# EAGLE design Decoder Accessori v2 (EAGLE 9.6.2)
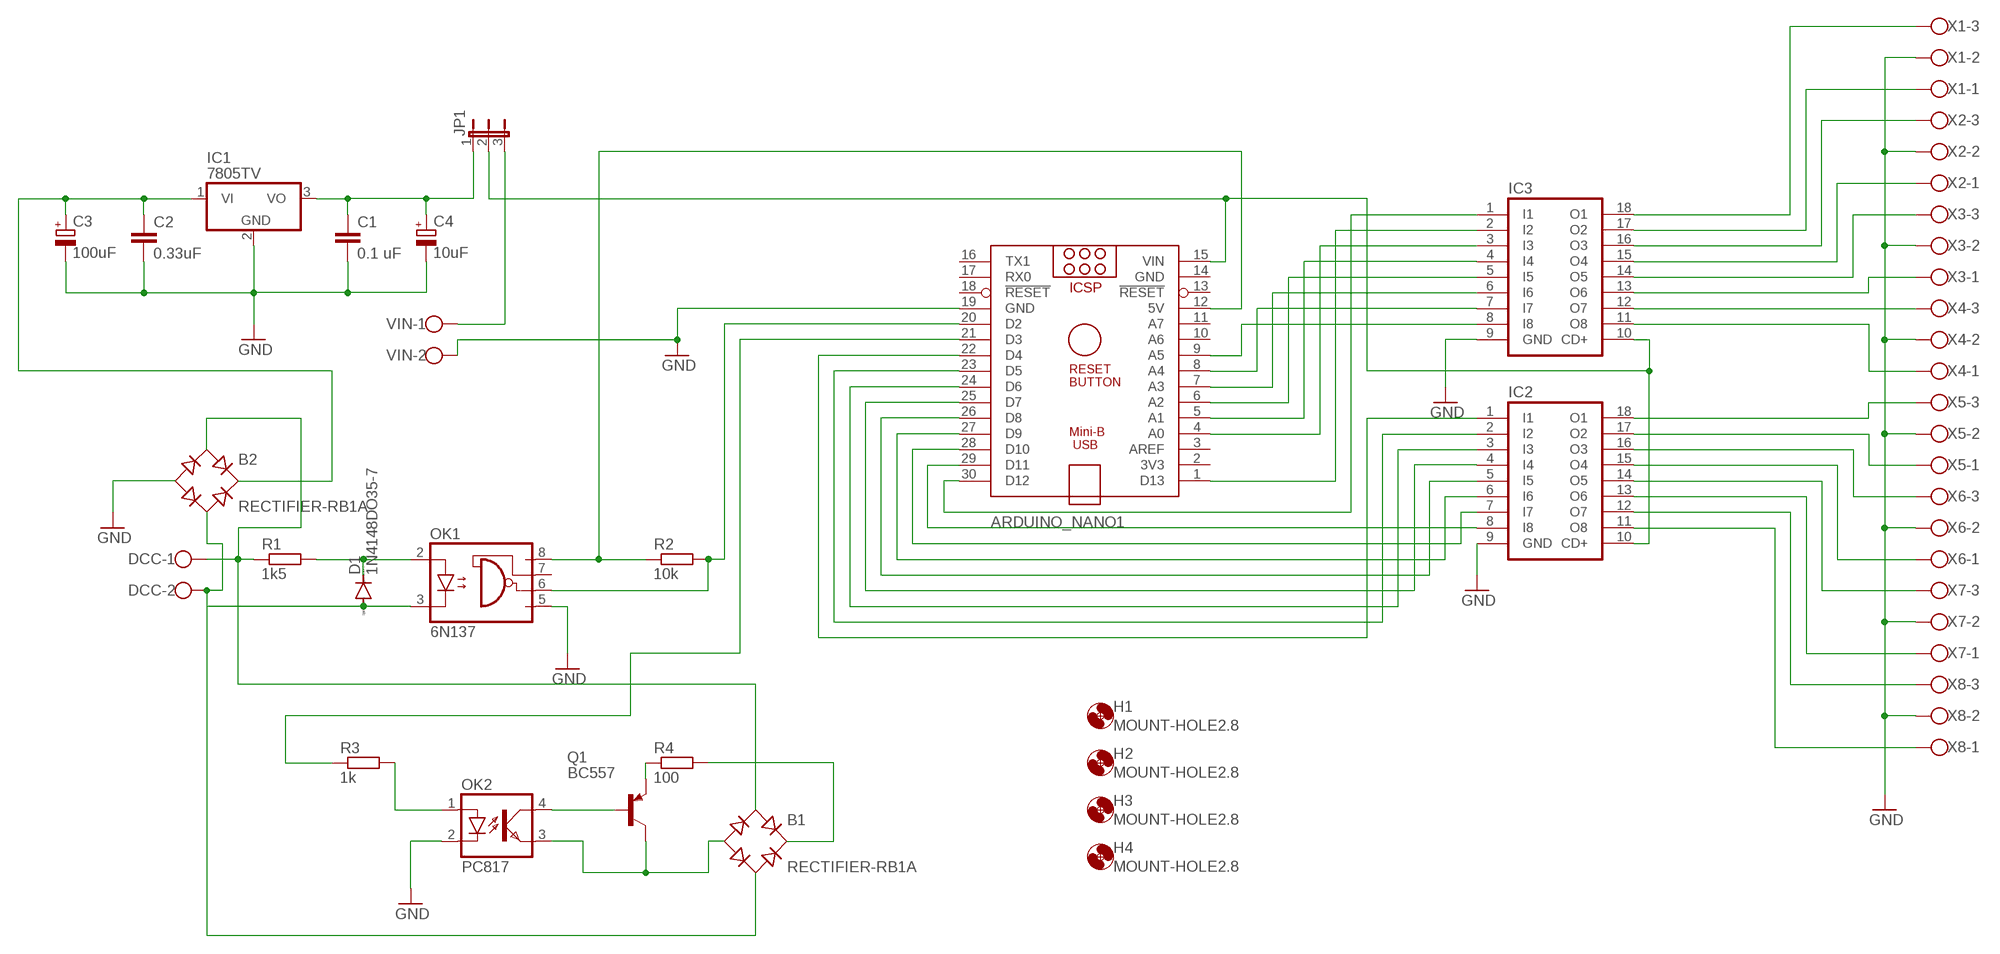
[diagram p0: schematic, sheet 1]

## Parts
ARDUINO_NANO1  ARDUINO_NANO  [ARDUINO_NANO]
B1  RECTIFIER-RB1A  [RB1A]
B2  RECTIFIER-RB1A  [RB1A]
C1  0.1 uF  C-EU025-024X044  [C025-024X044]
C2  0.33uF  C-EU025-024X044  [C025-024X044]
C3  100uF  CPOL-EUTAP5-50  [TAP5-50]
C4  10uF  CPOL-EUTAP5-50  [TAP5-50]
D1  1N4148DO35-7  [DO35-7]
DCC  W237-102  [W237-102]
H1  MOUNT-HOLE2.8  [2,8]
H2  MOUNT-HOLE2.8  [2,8]
H3  MOUNT-HOLE2.8  [2,8]
H4  MOUNT-HOLE2.8  [2,8]
IC1  7805TV  [TO220V]
IC2  ULN2803A  [DIL18]
IC3  ULN2803A  [DIL18]
JP1  JP2E  [JP2]
OK1  6N137  [DIL08]
OK2  PC817  [DIL04]
Q1  BC557  [TO92]
R1  1k5  R-EU_0207/10  [0207/10]
R2  10k  R-EU_0207/10  [0207/10]
R3  1k  R-EU_0207/10  [0207/10]
R4  100  R-EU_0207/10  [0207/10]
VIN  W237-102  [W237-102]
X1  W237-103  [W237-103]
X2  W237-103  [W237-103]
X3  W237-103  [W237-103]
X4  W237-103  [W237-103]
X5  W237-103  [W237-103]
X6  W237-103  [W237-103]
X7  W237-103  [W237-103]
X8  W237-103  [W237-103]

## Nets
GND [GND]: ARDUINO_NANO1.19(GND) B2.- C1.2 C2.2 C3.- C4.- IC1.2(GND) IC2.9(GND) IC3.9(GND) OK1.5(GND) OK2.2(C) VIN.2 X1.2 X2.2 X3.2 X4.2 X5.2 X6.2 X7.2 X8.2
N$1: D1.C OK1.2(A) R1.2
N$2 [DCC]: B1.AC2 B2.AC2 D1.A DCC.2 OK1.3(C)
N$3: ARDUINO_NANO1.12(5V) OK1.8(VCC) R2.1
N$4: ARDUINO_NANO1.20(D2) OK1.6(VO) R2.2
N$5 [DCC]: B1.AC1 B2.AC1 DCC.1 R1.1
N$6: OK2.4(COL) Q1.2(B)
N$7: ARDUINO_NANO1.21(D3) R3.1
N$8: OK2.1(A) R3.2
N$9: B1.- OK2.3(EMIT) Q1.3(C)
N$10: Q1.1(E) R4.1
N$11: B1.+ R4.2
N$12: ARDUINO_NANO1.29(D11) IC2.8(I8)
N$13: ARDUINO_NANO1.28(D10) IC2.7(I7)
N$14 [Vin]: B2.+ C2.1 C3.+ IC1.1(VI)
N$15 [Vin]: ARDUINO_NANO1.15(VIN) IC2.10(CD+) IC3.10(CD+) JP1.2
N$16: ARDUINO_NANO1.27(D9) IC2.6(I6)
N$17: ARDUINO_NANO1.26(D8) IC2.5(I5)
N$18: ARDUINO_NANO1.30(D12) IC3.1(I1)
N$19: ARDUINO_NANO1.25(D7) IC2.4(I4)
N$20: ARDUINO_NANO1.24(D6) IC2.3(I3)
N$21: ARDUINO_NANO1.23(D5) IC2.2(I2)
N$22: ARDUINO_NANO1.22(D4) IC2.1(I1)
N$23: ARDUINO_NANO1.1(D13) IC3.2(I2)
N$24: ARDUINO_NANO1.4(A0) IC3.3(I3)
N$25: ARDUINO_NANO1.6(A2) IC3.5(I5)
N$26: ARDUINO_NANO1.5(A1) IC3.4(I4)
N$27: ARDUINO_NANO1.7(A3) IC3.6(I6)
N$28: ARDUINO_NANO1.8(A4) IC3.7(I7)
N$29 [POWER]: IC3.11(O8) X4.1
N$30: ARDUINO_NANO1.9(A5) IC3.8(I8)
N$31 [POWER]: IC3.12(O7) X4.3
N$32 [POWER]: IC3.13(O6) X3.1
N$33 [POWER]: IC3.14(O5) X3.3
N$34 [POWER]: IC3.15(O4) X2.1
N$35 [POWER]: IC3.16(O3) X2.3
N$36 [POWER]: IC3.17(O2) X1.1
N$37 [POWER]: IC3.18(O1) X1.3
N$38 [POWER]: IC2.18(O1) X5.3
N$39 [POWER]: IC2.17(O2) X5.1
N$40 [POWER]: IC2.16(O3) X6.3
N$41 [POWER]: IC2.15(O4) X6.1
N$42 [POWER]: IC2.14(O5) X7.3
N$43 [POWER]: IC2.13(O6) X7.1
N$44 [POWER]: IC2.12(O7) X8.3
N$45 [POWER]: IC2.11(O8) X8.1
N$46 [Vin]: C1.1 C4.+ IC1.3(VO) JP1.1
N$47 [Vin]: JP1.3 VIN.1
Unconnected: ARDUINO_NANO1.2(3V3) ARDUINO_NANO1.3(AREF) ARDUINO_NANO1.10(A6) ARDUINO_NANO1.11(A7) ARDUINO_NANO1.13(!RESET) ARDUINO_NANO1.16(TX1) ARDUINO_NANO1.17(RX0) ARDUINO_NANO1.18(!RESET) OK1.7(VE)

## Power pins joined to a net without a drawn wire
GND: ARDUINO_NANO1.14(GND)

## Library data of the parts
ARDUINO_NANO1 = ArduinoNanoV30:ARDUINO_NANO: Arduino Nano V3.0 Overview: The Arduino Nano is a small, complete, and breadboard-friendly board based on the ATmega328 (Arduino Nano 3.x) or ATmega168 (Arduino Nano 2.x). It has more or less the same functionality of the Arduino Duemilanove, but in a different package. It lacks only a DC power jack, and works with a Mini-B USB cable instead of a standard one. The Nano was designed and is being produced by Gravitech. Specifications: Microcontroller Atmel ATmega168 or ATmega328 Operating Voltage (logic level) 5 V Input Voltage (recommended) 7-12 V Input Voltage (limits) 6-20 V Digital I/O Pins 14 (of which 6 provide PWM output) Analog Input Pins 8 DC Current per I/O Pin 40 mA Flash Memory 16 KB (ATmega168) or 32 KB (ATmega328) of which 2 KB used by bootloader SRAM 1 KB (ATmega168) or 2 KB (ATmega328) EEPROM 512 bytes (ATmega168) or 1 KB (ATmega328) Clock Speed 16 MHz Dimensions 0.73" x 1.70" Length 45 mm Width 18 mm Weigth 5 g Power: The Arduino Nano can be powered via the Mini-B USB connection, 6-20V unregulated external power supply (pin 30), or 5V regulated external power supply (pin 27). The power source is automatically selected to the highest voltage source. Memory: The ATmega168 has 16 KB of flash memory for storing code (of which 2 KB is used for the bootloader); the ATmega328 has 32 KB, (also with 2 KB used for the bootloader). The ATmega168 has 1 KB of SRAM and 512 bytes of EEPROM (which can be read and written with the EEPROM library); the ATmega328 has 2 KB of SRAM and 1 KB of EEPROM. Input and Output: Each of the 14 digital pins on the Nano can be used as an input or output, using pinMode(), digitalWrite(), and digitalRead() functions. They operate at 5 volts. Each pin can provide or receive a maximum of 40 mA and has an internal pull-up resistor (disconnected by default) of 20-50 kOhms. In addition, some pins have specialized functions. Visit Arduino - ArduinoBoardNano <https://www.arduino.cc/en/Main/ArduinoBoardNano>
B1 B2 = rectifier:RECTIFIER-: Rectifier
C1 C2 = rcl:C-EU: CAPACITOR, European symbol; SPICEPREFIX: C
C3 C4 = rcl:CPOL-EU: POLARIZED CAPACITOR, European symbol; SPICEPREFIX: C
D1 = diode:1N4148: DIODE high speed (Philips)
DCC VIN = con-wago-500:W237-102: WAGO SCREW CLAMP; MPN: 237-102; OC_FARNELL: unknown; OC_NEWARK: 70K9898
H1-H4 = holes:MOUNT-HOLE: MOUNTING HOLE with drill center marker
IC1 = linear:78*: Positive VOLTAGE REGULATOR Source: http://cache.national.com/ds/LM/LM78L05.pdf http://www.fairchildsemi.com/ds/LM/LM7805.pdf
IC2 IC3 = uln-udn:ULN2803A: DRIVER ARRAY
JP1 = jumper:JP2E: JUMPER
OK1 = optocoupler:6N137: MOTOROLA OPTO COUPLER; MPN: 6N137; OC_FARNELL: 1328376; OC_NEWARK: 52M1895
OK2 = optocoupler:PC817: SHARP OPTO COUPLER; MPN: PC817X4J000F; OC_FARNELL: 9707727; OC_NEWARK: 97K7059
Q1 = transistor-pnp:BC557: PNP Transistor
R1-R4 = rcl:R-EU_: RESISTOR, European symbol; SPICEPREFIX: R
X1-X8 = con-wago-500:W237-103: WAGO SCREW CLAMP; MPN: 237-103; OC_FARNELL: unknown; OC_NEWARK: 18M7116

## Net classes
0 default: width 0.254 mm, clearance 0.254 mm
1 POWER: width 0.635 mm, clearance 0.254 mm
2 DCC: width 0.508 mm, clearance 0.254 mm
3 Vin: width 0.762 mm, clearance 0.254 mm
4 Signals: width 0.381 mm, clearance 0.254 mm
5 GND: width 0.889 mm, clearance 0.254 mm

## Board
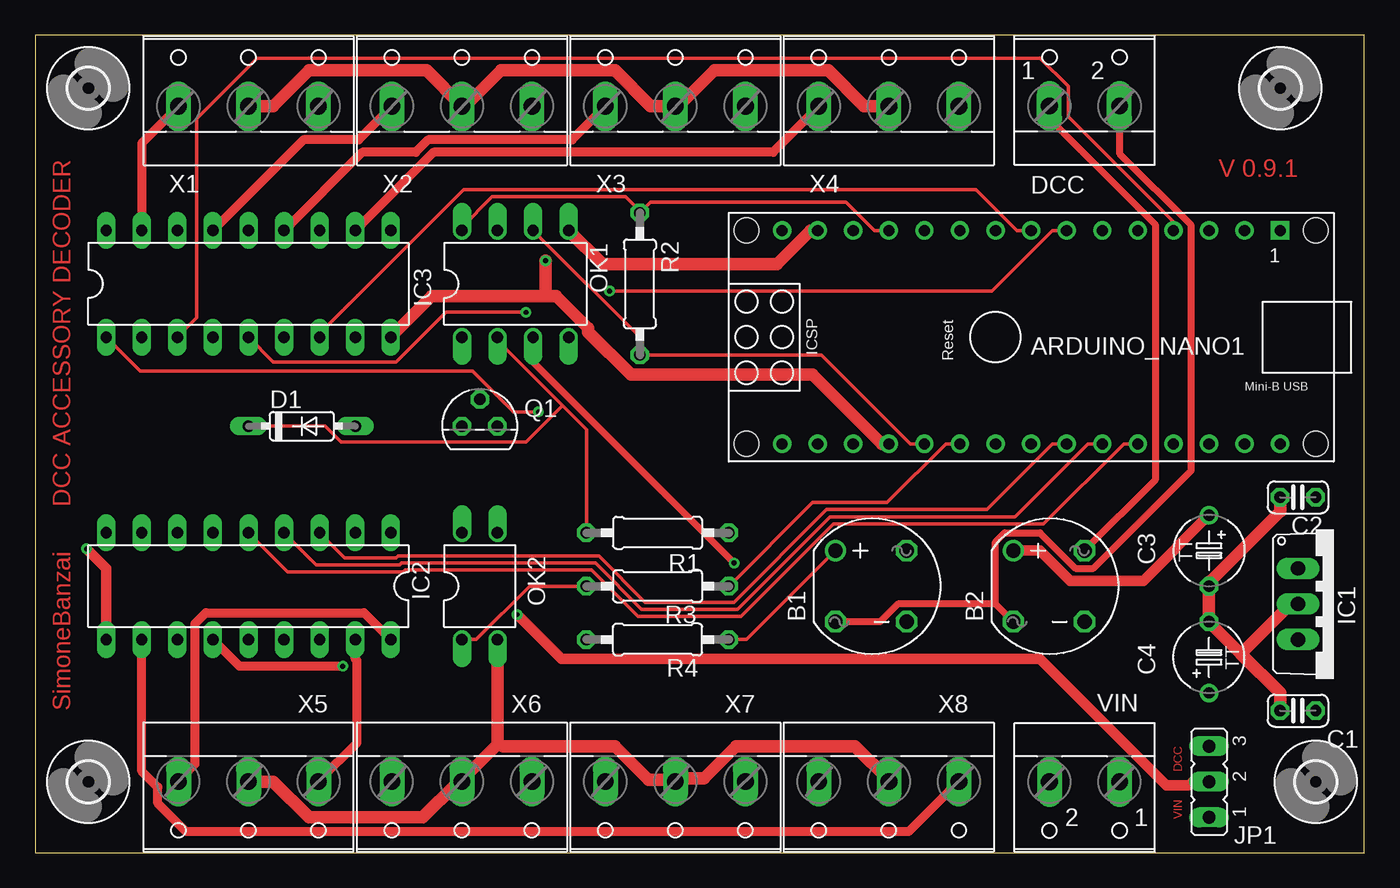
[diagram p1: board, top side]
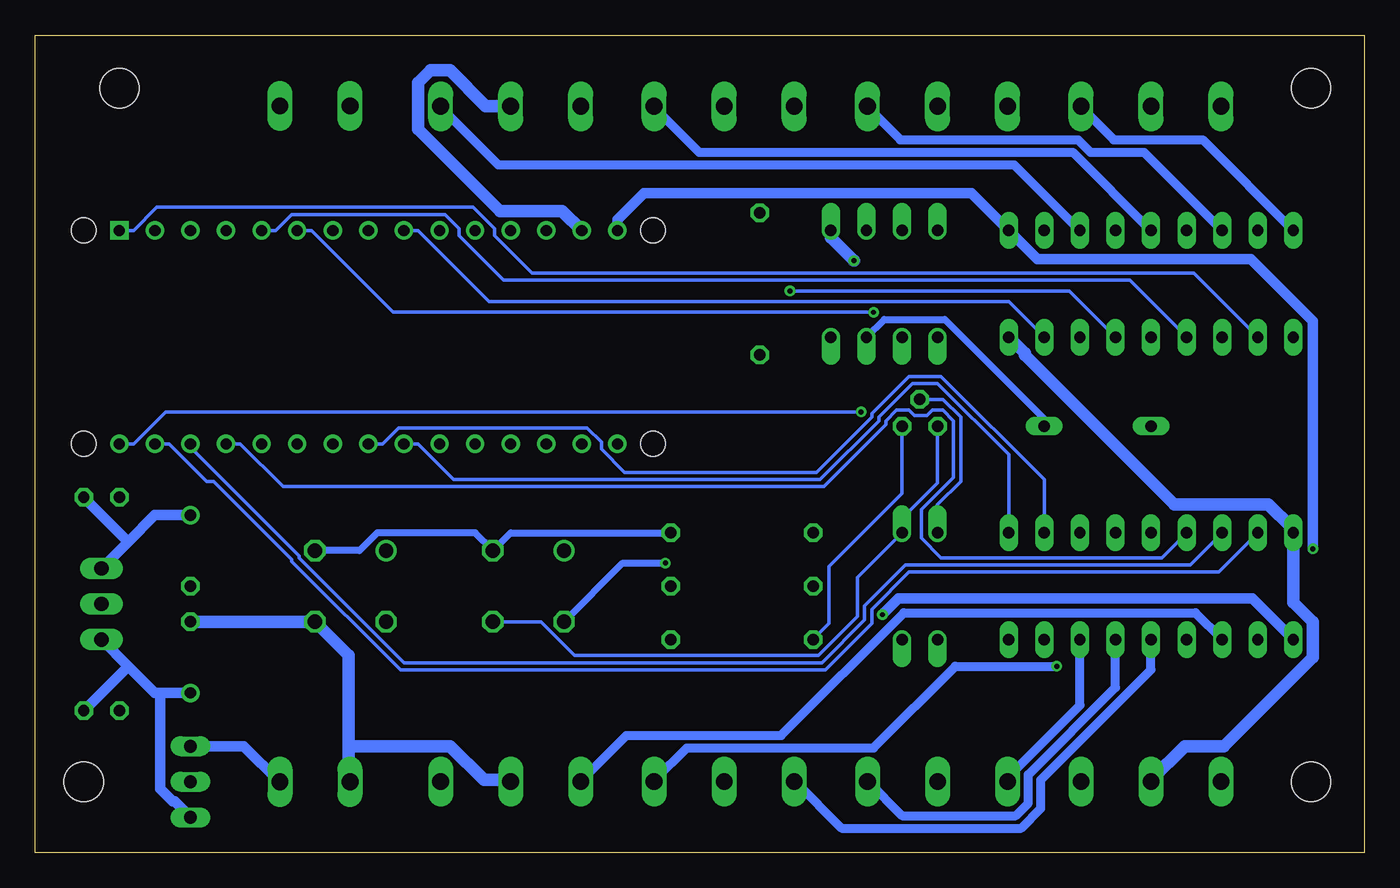
[diagram p2: board, bottom side, seen from below]

Size 94.92 x 58.41 mm. Coordinates in mm from the lower left corner, seen from the top.
Outline: 0,0 94.92,0 94.92,58.41 0,58.41 0,0
Copper layers (1*16): Top 0.035mm / dielectric 1.5mm / Bottom 0.035mm
Design rules "default *": minimum track width 10mil, minimum drill 0.35mm, track to track 6mil, track to pad 6mil, pad to pad 6mil, via to via 6mil, smd to smd 6mil, copper to edge 40mil, drill to drill 6mil, minimum pad ring 10mil, minimum via ring 8mil, stop-mask expansion 4mil, vias tented up to drill 0mil, thermal gap 10mil

### Footprints (pad centres in the part's own frame; a part is rotated, then mirrored left to right if it is on the bottom)
ARDUINO_NANO = drill 0.8 square: 1 -20.32,-7.62 | drill 0.8: 2 -17.78,-7.62; 3 -15.24,-7.62; 4 -12.7,-7.62; 5 -10.16,-7.62; 6 -7.62,-7.62; 7 -5.08,-7.62; 8 -2.54,-7.62; 9 0,-7.62; 10 2.54,-7.62; 11 5.08,-7.62; 12 7.62,-7.62; 13 10.16,-7.62; 14 12.7,-7.62; 15 15.24,-7.62; 16 15.24,7.62; 17 12.7,7.62; 18 10.16,7.62; 19 7.62,7.62; 20 5.08,7.62; 21 2.54,7.62; 22 0,7.62; 23 -2.54,7.62; 24 -5.08,7.62; 25 -7.62,7.62; 26 -10.16,7.62; 27 -12.7,7.62; 28 -15.24,7.62; 29 -17.78,7.62; 30 -20.32,7.62 | hole 1.778: -22.86,-7.62; -22.86,7.62; 17.78,7.62; 17.78,-7.62
RB1A = drill 1.016: + -2.54,2.54 | drill 1.016 octagon: - 2.54,-2.54; AC1 2.54,2.54; AC2 -2.54,-2.54
C025-024X044 = drill 0.813 octagon: 1 -1.27,0; 2 1.27,0
TAP5-50 = drill 0.813: + -2.54,0 | drill 0.813 octagon: - 2.54,0
DO35-7 = drill 0.813 long: A 3.81,0; C -3.81,0
W237-102 = drill 1.194 long: 1 -2.5,-1.27; 2 2.5,-1.27
2,8 = hole 2.8: 0,0
TO220V = drill 1.016 long: 1 -2.54,-2.54; 2 0,-2.54; 3 2.54,-2.54
DIL18 = drill 0.813 long: 1 -10.16,-3.81; 2 -7.62,-3.81; 3 -5.08,-3.81; 4 -2.54,-3.81; 5 0,-3.81; 6 2.54,-3.81; 7 5.08,-3.81; 8 7.62,-3.81; 9 10.16,-3.81; 10 10.16,3.81; 11 7.62,3.81; 12 5.08,3.81; 13 2.54,3.81; 14 0,3.81; 15 -2.54,3.81; 16 -5.08,3.81; 17 -7.62,3.81; 18 -10.16,3.81
JP2 = drill 0.914 long: 1 -2.54,0; 2 0,0; 3 2.54,0
DIL08 = drill 0.813 offset: 1 -3.81,-3.81; 2 -1.27,-3.81; 3 1.27,-3.81; 4 3.81,-3.81; 5 3.81,3.81; 6 1.27,3.81; 7 -1.27,3.81; 8 -3.81,3.81
DIL04 = drill 0.813 offset: 1 -1.27,-3.81; 2 1.27,-3.81; 3 1.27,3.81; 4 -1.27,3.81
TO92 = drill 0.813 octagon: 1 1.27,0; 2 0,1.905; 3 -1.27,0
0207/10 = drill 0.813 octagon: 1 -5.08,0; 2 5.08,0
W237-103 = drill 1.194 long: 1 -5,-1.29; 2 0,-1.29; 3 5,-1.29

### Placement (x,y rotation side)
ARDUINO_NANO1  68.58,36.83 180 top
B1  59.69,19.05 0 top
B2  72.39,19.05 0 top
C1  90.17,10.16 180 top
C2  90.17,25.4 180 top
C3  83.82,21.59 270 top
C4  83.82,13.97 90 top
D1  19.05,30.48 0 top
DCC  74.93,54.61 0 top
H1  3.81,5.08 0 top
H2  3.81,54.61 0 top
H3  91.44,5.08 0 top
H4  88.9,54.61 0 top
IC1  92.71,17.78 270 top
IC2  15.24,19.05 180 top
IC3  15.24,40.64 0 top
JP1  83.82,5.08 90 top
OK1  34.29,40.64 0 top
OK2  31.75,19.05 0 top
Q1  31.75,30.48 0 top
R1  44.45,22.86 180 top
R2  43.18,40.64 270 top
R3  44.45,19.05 180 top
R4  44.45,15.24 0 top
VIN  74.93,3.81 180 top
X1  15.24,54.61 0 top
X2  30.48,54.61 0 top
X3  45.72,54.61 0 top
X4  60.96,54.61 0 top
X5  15.24,3.81 180 top
X6  30.48,3.81 180 top
X7  45.72,3.81 180 top
X8  60.96,3.81 180 top

### Tracks (layer width: path | path; a pad name or v marks a point on that pad's centre or on a via)
GND  (via drill 0.35)
  Top 0.889: X1.2 15.24,53.34 17.02,53.34 19.56,55.88 27.94,55.88 30.48,53.34 X2.2 30.86,53.47 33.27,55.88 41.4,55.88 43.94,53.34 45.72,53.34 X3.2 46.1,53.47 48.51,55.88 56.64,55.88 59.18,53.34 60.96,53.34 X4.2 | ARDUINO_NANO1.14 55.37,44.45 52.96,42.04 40.51,42.04 OK1.5 | ARDUINO_NANO1.19 60.45,29.21 55.5,34.16 42.55,34.16 39.5,37.21 39.5,37.47 37.21,39.75 36.45,39.75 | 36.45,39.75 28.32,39.75 IC3.9 | 36.45,39.75 v36.45,42.29 | 33.02,7.75 OK2.2 | 33.02,7.75 30.48,5.21 X6.2 30.1,4.95 27.69,2.54 19.56,2.54 17.02,5.08 15.24,5.08 X5.2 | 33.02,7.75 33.4,7.62 41.4,7.62 43.82,5.21 45.72,5.21 X7.2 46.1,5.33 47.75,5.33 50.04,7.62 58.55,7.62 60.96,5.21 X8.2 | C1.2 88.9,11.43 86.11,14.22 | 86.11,14.22 C4.- C3.- 83.95,19.43 88.9,24.38 C2.2 | IC1.2 89.66,17.78 86.11,14.22
  Bottom 0.889: OK1.5 38.1,43.94 v36.45,42.29 | ARDUINO_NANO1.14 57.28,45.85 61.72,45.85 67.56,51.69 67.56,54.99 66.67,55.88 65.28,55.88 62.74,53.34 60.96,53.34 X4.2 | X5.2 15.24,5.21 12.83,7.62 10.03,7.62 3.68,13.97 3.68,16.51 5.08,17.91 IC2.9 5.21,23.24 6.86,24.89 13.59,24.89 24.26,35.56 24.26,35.69 IC3.9 | 72.52,7.62 72.52,14.1 B2.- C4.- | 72.52,7.62 72.52,5.08 VIN.2 | 72.52,7.62 65.28,7.62 62.86,5.21 60.96,5.21 X8.2
N$1
  Top 0.254: R1.2 39.37,30.23 37.66,31.94 | 37.66,31.94 33.02,36.58 OK1.2 | D1.C 20.7,30.48 21.84,29.34 35.05,29.34 37.66,31.94
N$2  (via drill 0.35)
  Top 0.508: B1.AC2 60.33,16.51 61.59,17.78 68.58,17.78 | B2.AC2 68.58,17.78 | 68.58,17.78 68.58,22.23 69.22,22.86 71.75,22.86 74.3,20.32 75.56,20.32 82.55,27.3 82.55,44.83 77.47,49.91 77.47,53.34 DCC.2 | OK1.3 35.56,35.05 v49.91,20.7
  Bottom 0.508: D1.A 22.86,30.99 29.97,38.1 34.29,38.1 OK1.3 | v49.91,20.7 52.96,20.7 B1.AC2
N$3
  Top 0.254: ARDUINO_NANO1.12 59.94,44.45 57.91,46.48 43.94,46.48 R2.1 43.18,45.85 42.16,46.86 32.64,46.86 30.48,44.7 OK1.8
N$4
  Top 0.254: ARDUINO_NANO1.20 62.48,29.21 56.13,35.56 R2.2 43.18,36.83 OK1.6
N$5
  Top 0.508: B2.AC1 80.01,26.67 80.01,44.83 72.52,52.32 72.52,53.34 DCC.1
  Bottom 0.508: R1.1 60.96,22.86 B1.AC1 63.5,22.86 70.48,22.86 71.75,21.59 B2.AC1
N$6
  Bottom 0.254: OK2.4 30.48,24.89 28.83,26.54 28.83,31.12 30.1,32.38 Q1.2
N$7
  Top 0.254: ARDUINO_NANO1.21 65.02,29.21 60.83,25.02 55.5,25.02 R3.1
N$8
  Top 0.254: OK2.1 31.5,15.24 35.31,19.05 R3.2
N$9
  Bottom 0.254: Q1.3 30.48,26.42 33.02,23.88 OK2.3 36.2,19.69 36.2,16.89 38.99,14.1 56.39,14.1 58.8,16.51 B1.-
N$10
  Bottom 0.254: Q1.1 33.02,25.65 38.23,20.45 38.23,16.38 R4.1
N$11
  Top 0.254: R4.2 50.8,15.24 B1.+
N$12
  Bottom 0.254: ARDUINO_NANO1.29 85.34,29.21 82.68,26.54 82.17,26.54 76.58,20.96 76.58,20.83 68.83,13.08 38.48,13.08 35.18,16.38 35.18,17.4 32.51,20.07 10.41,20.07 IC2.8
N$13
  Bottom 0.254: ARDUINO_NANO1.28 83.82,28.96 76.07,21.21 76.07,21.08 68.58,13.59 38.73,13.59 35.69,16.64 35.69,17.65 32.77,20.57 12.45,20.57 IC2.7
N$14
  Top 0.762: B2.+ 71.75,21.59 73.91,19.43 79.12,19.43 C3.+
  Bottom 0.762: C3.+ 86.36,24.13 88.27,22.23 | IC1.1 88.27,22.23 | 88.27,22.23 C2.1
N$15  (via drill 0.35)
  Top 0.762: IC2.10 5.08,20.32 v3.68,21.72 | JP1.2 82.68,5.08 82.42,4.83 80.77,4.83 71.75,13.84 37.59,13.84 v34.42,17.02
  Bottom 0.762: ARDUINO_NANO1.15 53.34,45.21 51.44,47.12 28.07,47.12 IC3.10 23.37,42.42 8.13,42.42 3.68,37.97 v3.68,21.72 | v34.42,17.02 33.27,18.16 8,18.16 IC2.10
N$16
  Bottom 0.254: ARDUINO_NANO1.27 80.26,29.21 77.22,26.16 38.61,26.16 34.16,30.61 34.16,30.86 33.4,31.62 32.51,31.62 32.13,31.24 31.24,31.24 30.86,31.62 30.1,31.62 29.34,30.86 29.34,26.8 31.62,24.51 31.62,22.48 30.23,21.08 14.48,21.08 IC2.6
N$17
  Top 0.254: ARDUINO_NANO1.26 77.72,29.21 72.01,23.5 57.02,23.5 50.42,16.89 43.05,16.89 39.75,20.19 26.42,20.19 26.29,20.07 18.03,20.07 IC2.5
N$18  (via drill 0.35)
  Top 0.254: v35.94,31.5 34.16,31.5 31.24,34.42 7.49,34.42 IC3.1
  Bottom 0.254: ARDUINO_NANO1.30 87.88,29.21 85.6,31.5 v35.94,31.5
N$19
  Top 0.254: ARDUINO_NANO1.25 75.18,29.21 69.98,24 56.77,24 50.16,17.4 43.31,17.4 40.01,20.7 26.16,20.7 26.03,20.57 20.07,20.57 IC2.4
N$20
  Top 0.254: ARDUINO_NANO1.24 72.64,29.21 67.95,24.51 56.52,24.51 49.91,17.91 43.56,17.91 40.26,21.21 25.91,21.21 25.78,21.08 22.1,21.08 IC2.3
N$21
  Bottom 0.254: ARDUINO_NANO1.23 70.1,29.21 68.96,30.35 55.5,30.35 54.48,29.34 54.48,28.83 52.83,27.18 39.12,27.18 35.18,31.12 35.18,31.37 32.51,34.04 30.23,34.04 22.86,26.67 IC2.2
N$22
  Bottom 0.254: ARDUINO_NANO1.22 67.56,29.21 65.02,26.67 38.86,26.67 34.67,30.86 34.67,31.12 32.26,33.53 30.48,33.53 25.4,28.45 IC2.1
N$23
  Bottom 0.254: ARDUINO_NANO1.1 87.88,44.45 86.23,46.1 63.63,46.1 62.1,44.58 62.1,44.07 59.44,41.4 12.19,41.4 IC3.2
N$24
  Top 0.254: ARDUINO_NANO1.4 81.28,45.09 73.79,52.58 73.79,54.74 71.75,56.77 15.87,56.77 11.56,52.45 11.56,38.23 IC3.3
N$25  (via drill 0.35)
  Top 0.254: v35.05,38.61 29.34,38.61 25.78,35.05 17.02,35.05 IC3.5
  Bottom 0.254: ARDUINO_NANO1.6 75.18,44.45 69.34,38.61 v35.05,38.61
N$26
  Bottom 0.254: ARDUINO_NANO1.5 77.72,44.45 76.58,45.59 65.66,45.59 64.64,44.58 64.64,44.07 61.47,40.89 16.76,40.89 IC3.4
N$27  (via drill 0.35)
  Top 0.254: ARDUINO_NANO1.7 72.64,44.45 68.33,40.13 v41.02,40.13
  Bottom 0.254: v41.02,40.13 21.08,40.13 IC3.6
N$28
  Top 0.254: ARDUINO_NANO1.8 70.1,44.45 67.18,47.37 30.61,47.37 20.32,37.08 IC3.7
N$29
  Top 0.635: IC3.11 28.45,50.04 52.7,50.04 55.88,53.21 X4.1
N$30
  Bottom 0.254: ARDUINO_NANO1.9 67.56,44.45 62.48,39.37 25.4,39.37 IC3.8
N$31
  Bottom 0.635: IC3.12 25.02,49.15 61.85,49.15 65.91,53.21 X4.3
N$32
  Top 0.635: IC3.13 23.37,50.04 27.18,50.04 28.07,50.93 38.35,50.93 40.64,53.21 X3.1
N$33
  Bottom 0.635: IC3.14 20.83,50.04 47.5,50.04 50.67,53.21 X3.3
N$34
  Top 0.635: IC3.15 19.18,50.93 23.11,50.93 25.4,53.21 X2.1
N$35
  Bottom 0.635: IC3.16 15.75,50.04 19.56,50.04 20.45,50.93 33.15,50.93 35.43,53.21 X2.3
N$36
  Top 0.635: IC3.17 7.62,50.67 10.16,53.21 X1.1
N$37
  Bottom 0.635: IC3.18 11.56,50.93 17.91,50.93 20.19,53.21 X1.3
N$38
  Top 0.635: IC2.18 23.49,17.14 12.19,17.14 11.43,16.38 11.43,6.35 10.29,5.21 X5.3
N$39
  Top 0.635: IC2.17 22.86,13.84 22.99,13.72 22.99,7.87 20.32,5.21 X5.1
N$40
  Bottom 0.635: IC2.16 20.32,10.54 25.4,5.46 25.4,5.21 X6.3
N$41
  Bottom 0.635: IC2.15 17.78,11.81 24,5.59 24,3.56 24.89,2.67 33.02,2.67 35.43,5.08 X6.1
N$42
  Bottom 0.635: IC2.14 15.24,13.08 23.11,5.21 23.11,3.17 24.51,1.78 37.34,1.78 40.64,5.08 X7.3
N$43  (via drill 0.35)
  Top 0.635: IC2.13 14.6,13.34 v21.97,13.34
  Bottom 0.635: v21.97,13.34 29.21,13.34 35.05,7.49 48.39,7.49 50.67,5.21 X7.1
N$44
  Bottom 0.635: IC2.12 12.06,17.14 32.89,17.14 41.66,8.38 52.7,8.38 55.88,5.21 X8.3
N$45
  Top 0.635: IC2.11 7.62,5.84 8.76,4.7 8.76,3.56 10.79,1.52 62.36,1.52 65.91,5.08 X8.1
N$46
  Bottom 0.762: 85.98,11.43 86.36,11.43 88.27,13.34 | 85.98,11.43 C4.+ | IC1.3 88.27,13.34 | 88.27,13.34 C1.1 | JP1.1 84.96,3.68 85.09,3.68 85.98,4.57 85.98,11.43
N$47
  Bottom 0.762: JP1.3 80.01,7.62 77.47,5.08 VIN.1

### Text on the board
Top: DCC ACCESSORY DECODER | V 0.9.1 | SimoneBanzai | DCC | VIN